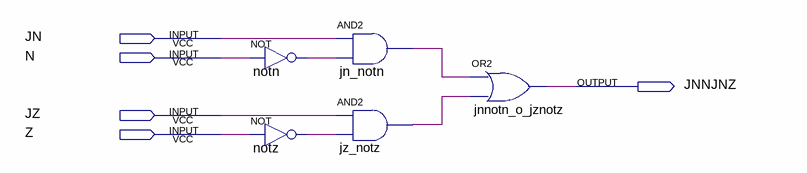
[diagram p0: schematic sheet]
// Quartus schematic JNNJNZ.bdf as structural Verilog: 5 symbols, 5 pins
module JNNJNZ (
  input  JN,
  input  N,
  input  JZ,
  input  Z,
  output JNNJNZ
);

  wire jn_notn_out, jz_notz_out, notn_out, notz_out;

  not notn (notn_out, N);
  not notz (notz_out, Z);
  and jn_notn (jn_notn_out, JN, notn_out);
  and jz_notz (jz_notz_out, JZ, notz_out);
  or jnnotn_o_jznotz (JNNJNZ, jn_notn_out, jz_notz_out);
endmodule
